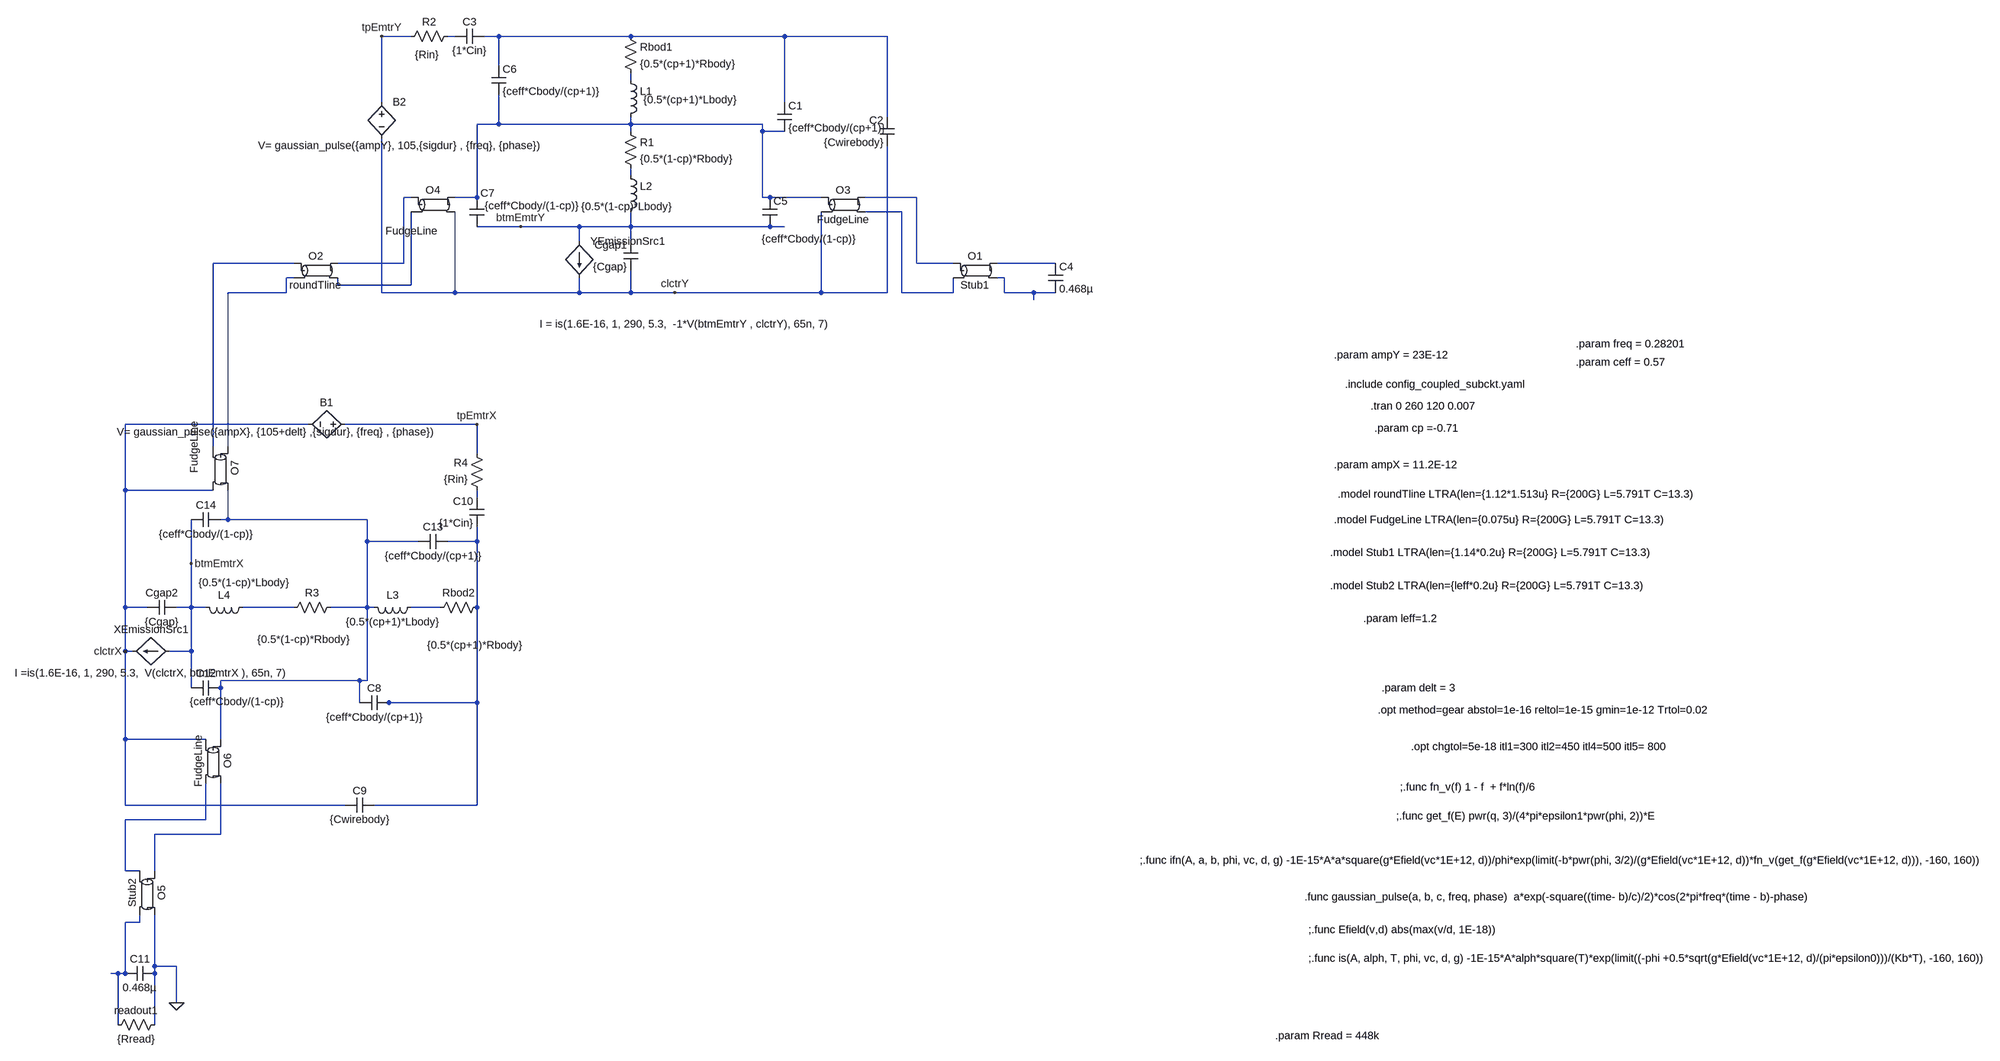
[diagram p0: schematic 2_coupled_antennas_with_currentCopy.asc]
2_coupled_antennas_with_currentCopy.asc, the LTspice schematic file:
Version 4.1
SHEET 1 2492 680
WIRE -1648 -1776 -1712 -1776
WIRE -1552 -1776 -1568 -1776
WIRE -1456 -1776 -1488 -1776
WIRE -1168 -1776 -1456 -1776
WIRE -832 -1776 -1168 -1776
WIRE -608 -1776 -832 -1776
WIRE -1456 -1712 -1456 -1776
WIRE -1168 -1680 -1168 -1696
WIRE -1712 -1632 -1712 -1776
WIRE -832 -1632 -832 -1776
WIRE -608 -1600 -608 -1776
WIRE -1456 -1584 -1456 -1648
WIRE -1456 -1584 -1504 -1584
WIRE -1168 -1584 -1168 -1600
WIRE -1168 -1584 -1456 -1584
WIRE -880 -1584 -1168 -1584
WIRE -1168 -1568 -1168 -1584
WIRE -880 -1568 -880 -1584
WIRE -832 -1568 -880 -1568
WIRE -1168 -1472 -1168 -1488
WIRE -1648 -1424 -1664 -1424
WIRE -1504 -1424 -1504 -1584
WIRE -1504 -1424 -1552 -1424
WIRE -880 -1424 -880 -1568
WIRE -864 -1424 -880 -1424
WIRE -752 -1424 -864 -1424
WIRE -544 -1424 -656 -1424
WIRE -1504 -1408 -1504 -1424
WIRE -576 -1392 -656 -1392
WIRE -1408 -1360 -1504 -1360
WIRE -1280 -1360 -1408 -1360
WIRE -1168 -1360 -1168 -1392
WIRE -1168 -1360 -1280 -1360
WIRE -864 -1360 -1168 -1360
WIRE -832 -1360 -864 -1360
WIRE -1280 -1328 -1280 -1360
WIRE -1168 -1328 -1168 -1360
WIRE -1904 -1280 -2080 -1280
WIRE -1664 -1280 -1664 -1424
WIRE -1664 -1280 -1808 -1280
WIRE -544 -1280 -544 -1424
WIRE -464 -1280 -544 -1280
WIRE -240 -1280 -368 -1280
WIRE -1904 -1248 -1920 -1248
WIRE -352 -1248 -368 -1248
WIRE -1808 -1232 -1808 -1248
WIRE -1648 -1232 -1648 -1392
WIRE -1648 -1232 -1808 -1232
WIRE -1920 -1216 -1920 -1248
WIRE -1920 -1216 -2048 -1216
WIRE -1712 -1216 -1712 -1552
WIRE -1552 -1216 -1552 -1392
WIRE -1552 -1216 -1712 -1216
WIRE -1280 -1216 -1280 -1248
WIRE -1280 -1216 -1552 -1216
WIRE -1168 -1216 -1168 -1264
WIRE -1168 -1216 -1280 -1216
WIRE -1072 -1216 -1168 -1216
WIRE -752 -1216 -752 -1392
WIRE -752 -1216 -1072 -1216
WIRE -608 -1216 -608 -1536
WIRE -608 -1216 -752 -1216
WIRE -576 -1216 -576 -1392
WIRE -464 -1216 -464 -1248
WIRE -464 -1216 -576 -1216
WIRE -352 -1216 -352 -1248
WIRE -288 -1216 -352 -1216
WIRE -240 -1216 -288 -1216
WIRE -288 -1200 -288 -1216
WIRE -1872 -928 -2272 -928
WIRE -1504 -928 -1792 -928
WIRE -2080 -880 -2080 -1280
WIRE -2048 -880 -2048 -1216
WIRE -1504 -864 -1504 -928
WIRE -2272 -784 -2272 -928
WIRE -2080 -784 -2272 -784
WIRE -1504 -768 -1504 -784
WIRE -2048 -720 -2048 -784
WIRE -2048 -720 -2064 -720
WIRE -1744 -720 -2048 -720
WIRE -1744 -672 -1744 -720
WIRE -1632 -672 -1744 -672
WIRE -1504 -672 -1504 -704
WIRE -1504 -672 -1568 -672
WIRE -2128 -624 -2128 -720
WIRE -2272 -528 -2272 -784
WIRE -2224 -528 -2272 -528
WIRE -2128 -528 -2128 -624
WIRE -2128 -528 -2160 -528
WIRE -2096 -528 -2128 -528
WIRE -1904 -528 -2016 -528
WIRE -1744 -528 -1744 -672
WIRE -1744 -528 -1824 -528
WIRE -1728 -528 -1744 -528
WIRE -1584 -528 -1648 -528
WIRE -1504 -528 -1504 -672
WIRE -2272 -432 -2272 -528
WIRE -2256 -432 -2272 -432
WIRE -2128 -432 -2128 -528
WIRE -2128 -432 -2176 -432
WIRE -1760 -368 -2064 -368
WIRE -1744 -368 -1744 -528
WIRE -1744 -368 -1760 -368
WIRE -2128 -352 -2128 -432
WIRE -2064 -352 -2064 -368
WIRE -1760 -320 -1760 -368
WIRE -1696 -320 -1712 -320
WIRE -1504 -320 -1504 -528
WIRE -1504 -320 -1696 -320
WIRE -2272 -240 -2272 -432
WIRE -2096 -240 -2272 -240
WIRE -2064 -240 -2064 -352
WIRE -2272 -96 -2272 -240
WIRE -1792 -96 -2272 -96
WIRE -1504 -96 -1504 -320
WIRE -1504 -96 -1728 -96
WIRE -2096 -64 -2096 -144
WIRE -2096 -64 -2272 -64
WIRE -2064 -32 -2064 -144
WIRE -2064 -32 -2208 -32
WIRE -2272 48 -2272 -64
WIRE -2240 48 -2272 48
WIRE -2208 48 -2208 -32
WIRE -2240 160 -2240 144
WIRE -2240 160 -2272 160
WIRE -2208 256 -2208 144
WIRE -2160 256 -2208 256
WIRE -2288 272 -2304 272
WIRE -2272 272 -2272 160
WIRE -2272 272 -2288 272
WIRE -2208 272 -2208 256
WIRE -2160 336 -2160 256
WIRE -2288 384 -2288 272
WIRE -2208 384 -2208 272
FLAG -1408 -1360 btmEmtrY
FLAG -1072 -1216 clctrY
FLAG -1712 -1776 tpEmtrY
FLAG -2128 -624 btmEmtrX
FLAG -2272 -432 clctrX
FLAG -1504 -928 tpEmtrX
FLAG -2160 336 0
SYMBOL cap -848 -1632 R0
SYMATTR InstName C1
SYMATTR Value {ceff*Cbody/(cp+1)}
SYMBOL cap -1152 -1264 R180
WINDOW 0 24 56 Left 2
WINDOW 3 24 8 Left 2
SYMATTR InstName Cgap1
SYMATTR Value {Cgap}
SYMBOL cap -592 -1536 R180
WINDOW 0 24 56 Left 2
WINDOW 3 24 8 Left 2
SYMATTR InstName C2
SYMATTR Value {Cwirebody}
SYMBOL res -1184 -1792 R0
SYMATTR InstName Rbod1
SYMATTR Value {0.5*(cp+1)*Rbody}
SYMBOL res -1184 -1584 R0
SYMATTR InstName R1
SYMATTR Value {0.5*(1-cp)*Rbody}
SYMBOL ind -1184 -1696 R0
WINDOW 3 44 59 Left 2
SYMATTR Value {0.5*(cp+1)*Lbody}
SYMATTR InstName L1
SYMBOL ind -1184 -1488 R0
WINDOW 3 -92 84 Left 2
SYMATTR Value {0.5*(1-cp)*Lbody}
SYMATTR InstName L2
SYMBOL res -1552 -1792 R90
WINDOW 0 0 56 VBottom 2
WINDOW 3 41 61 VTop 2
SYMATTR InstName R2
SYMATTR Value {Rin}
SYMBOL cap -1488 -1792 R90
WINDOW 0 0 32 VBottom 2
WINDOW 3 32 32 VTop 2
SYMATTR InstName C3
SYMATTR Value {1*Cin}
SYMBOL ltline -416 -1264 R0
SYMATTR InstName O1
SYMATTR Value Stub1
SYMBOL ltline -1856 -1264 R0
SYMATTR InstName O2
SYMATTR Value roundTline
SYMBOL cap -256 -1280 R0
SYMATTR InstName C4
SYMATTR Value 0.468µ
SYMBOL cap -880 -1424 R0
WINDOW 3 -2 91 Left 2
SYMATTR Value {ceff*Cbody/(1-cp)}
SYMATTR InstName C5
SYMBOL cap -1472 -1712 R0
SYMATTR InstName C6
SYMATTR Value {ceff*Cbody/(cp+1)}
SYMBOL cap -1520 -1424 R0
WINDOW 0 24 -9 Left 2
WINDOW 3 33 18 Left 2
SYMATTR InstName C7
SYMATTR Value {ceff*Cbody/(1-cp)}
SYMBOL ltline -704 -1408 R0
SYMATTR InstName O3
SYMATTR Value FudgeLine
SYMBOL ltline -1600 -1408 R0
WINDOW 3 -46 42 Top 2
SYMATTR Value FudgeLine
SYMATTR InstName O4
SYMBOL cap -1696 -336 R90
WINDOW 0 0 32 VBottom 2
WINDOW 3 32 32 VTop 2
SYMATTR InstName C8
SYMATTR Value {ceff*Cbody/(cp+1)}
SYMBOL cap -2224 -512 R270
WINDOW 0 32 32 VTop 2
WINDOW 3 0 32 VBottom 2
SYMATTR InstName Cgap2
SYMATTR Value {Cgap}
SYMBOL cap -1792 -80 R270
WINDOW 0 32 32 VTop 2
WINDOW 3 0 32 VBottom 2
SYMATTR InstName C9
SYMATTR Value {Cwirebody}
SYMBOL res -1488 -544 R90
WINDOW 0 0 56 VBottom 2
WINDOW 3 83 21 VTop 2
SYMATTR InstName Rbod2
SYMATTR Value {0.5*(cp+1)*Rbody}
SYMBOL res -1808 -544 R90
WINDOW 0 0 56 VBottom 2
WINDOW 3 70 75 VTop 2
SYMATTR InstName R3
SYMATTR Value {0.5*(1-cp)*Rbody}
SYMBOL ind -1632 -544 R90
WINDOW 3 32 56 VTop 2
WINDOW 0 5 56 VBottom 2
SYMATTR Value {0.5*(cp+1)*Lbody}
SYMATTR InstName L3
SYMBOL ind -2000 -544 R90
WINDOW 3 -54 13 VTop 2
WINDOW 0 5 56 VBottom 2
SYMATTR Value {0.5*(1-cp)*Lbody}
SYMATTR InstName L4
SYMBOL res -1488 -768 R180
WINDOW 0 36 76 Left 2
WINDOW 3 36 40 Left 2
SYMATTR InstName R4
SYMATTR Value {Rin}
SYMBOL cap -1488 -704 R180
WINDOW 0 24 56 Left 2
WINDOW 3 24 8 Left 2
SYMATTR InstName C10
SYMATTR Value {1*Cin}
SYMBOL ltline -2224 96 R90
SYMATTR InstName O5
SYMATTR Value Stub2
SYMBOL cap -2208 256 R90
WINDOW 0 0 32 VBottom 2
WINDOW 3 31 33 VTop 2
SYMATTR InstName C11
SYMATTR Value 0.468µ
SYMBOL cap -2064 -368 R90
WINDOW 3 30 -35 VTop 2
WINDOW 0 0 32 VBottom 2
SYMATTR Value {ceff*Cbody/(1-cp)}
SYMATTR InstName C12
SYMBOL cap -1568 -688 R90
WINDOW 0 0 32 VBottom 2
WINDOW 3 32 32 VTop 2
SYMATTR InstName C13
SYMATTR Value {ceff*Cbody/(cp+1)}
SYMBOL cap -2064 -736 R90
WINDOW 0 0 32 VBottom 2
WINDOW 3 32 32 VTop 2
SYMATTR InstName C14
SYMATTR Value {ceff*Cbody/(1-cp)}
SYMBOL ltline -2080 -192 R90
SYMATTR InstName O6
SYMATTR Value FudgeLine
SYMBOL ltline -2064 -832 R90
WINDOW 3 -46 42 Top 2
SYMATTR Value FudgeLine
SYMATTR InstName O7
SYMBOL bi -1280 -1328 R0
WINDOW 3 -87 181 Left 2
SYMATTR Value I = is(1.6E-16, 1, 290, 5.3,  -1*V(btmEmtrY , clctrY), 65n, 7)
SYMATTR InstName YEmissionSrc1
SYMBOL bi -2176 -432 R90
WINDOW 3 32 40 VTop 2
WINDOW 0 -32 40 VBottom 2
SYMATTR Value I =is(1.6E-16, 1, 290, 5.3,  V(clctrX, btmEmtrX ), 65n, 7)
SYMATTR InstName XEmissionSrc1
SYMBOL bv -1776 -928 R90
WINDOW 3 1 167 VTop 2
WINDOW 0 -32 56 VBottom 2
SYMATTR Value V= gaussian_pulse({ampX}, {105+delt} ,{sigdur}, {freq} , {phase})
SYMATTR InstName B1
SYMBOL bv -1712 -1648 R0
WINDOW 3 -270 111 Left 2
SYMATTR Value V= gaussian_pulse({ampY}, 105,{sigdur} , {freq}, {phase})
SYMATTR InstName B2
SYMBOL res -2192 368 R90
WINDOW 0 0 56 VBottom 2
WINDOW 3 32 56 VTop 2
SYMATTR InstName readout1
SYMATTR Value {Rread}
TEXT 832 -1016 Left 2 !.include config_coupled_subckt.yaml
TEXT 888 -968 Left 2 !.tran 0 260 120 0.007
TEXT 904 -304 Left 2 !.opt method=gear abstol=1e-16 reltol=1e-15 gmin=1e-12 Trtol=0.02
TEXT 976 -224 Left 2 !.opt chgtol=5e-18 itl1=300 itl2=450 itl4=500 itl5= 800
TEXT 952 -136 Left 2 !;.func fn_v(f) 1 - f  + f*ln(f)/6
TEXT 944 -72 Left 2 !;.func get_f(E) pwr(q, 3)/(4*pi*epsilon1*pwr(phi, 2))*E
TEXT 384 24 Left 2 !;.func ifn(A, a, b, phi, vc, d, g) -1E-15*A*a*square(g*Efield(vc*1E+12, d))/phi*exp(limit(-b*pwr(phi, 3/2)/(g*Efield(vc*1E+12, d))*fn_v(get_f(g*Efield(vc*1E+12, d))), -160, 160))
TEXT 744 104 Left 2 !.func gaussian_pulse(a, b, c, freq, phase)  a*exp(-square((time- b)/c)/2)*cos(2*pi*freq*(time - b)-phase)
TEXT 752 176 Left 2 !;.func Efield(v,d) abs(max(v/d, 1E-18))\n \n;.func is(A, alph, T, phi, vc, d, g) -1E-15*A*alph*square(T)*exp(limit((-phi +0.5*sqrt(g*Efield(vc*1E+12, d)/(pi*epsilon0)))/(Kb*T), -160, 160))
TEXT 808 -1080 Left 2 !.param ampY = 23E-12
TEXT 808 -840 Left 2 !.param ampX = 11.2E-12
TEXT 912 -352 Left 2 !.param delt = 3
TEXT 680 408 Left 2 !.param Rread = 448k
TEXT 1336 -1104 Left 2 !.param freq = 0.28201
TEXT 1336 -1064 Left 2 !.param ceff = 0.57
TEXT 816 -776 Left 2 !.model roundTline LTRA(len={1.12*1.513u} R={200G} L=5.791T C=13.3)
TEXT 808 -720 Left 2 !.model FudgeLine LTRA(len={0.075u} R={200G} L=5.791T C=13.3)
TEXT 800 -648 Left 2 !.model Stub1 LTRA(len={1.14*0.2u} R={200G} L=5.791T C=13.3)
TEXT 800 -576 Left 2 !.model Stub2 LTRA(len={leff*0.2u} R={200G} L=5.791T C=13.3)
TEXT 896 -920 Left 2 !.param cp =-0.71
TEXT 872 -504 Left 2 !.param leff=1.2

The netlist it stands for:
* 2_coupled_antennas_with_currentCopy.asc
C1 N002 N004 {ceff*Cbody/(cp+1)}
Cgap1 clctrY btmEmtrY {Cgap}
C2 clctrY N002 {Cwirebody}
Rbod1 N002 N003 {0.5*(cp+1)*Rbody}
R1 N004 N005 {0.5*(1-cp)*Rbody}
L1 N003 N004 {0.5*(cp+1)*Lbody}
L2 N005 btmEmtrY {0.5*(1-cp)*Lbody}
R2 N001 tpEmtrY {Rin}
C3 N002 N001 {1*Cin}
O1 N007 N008 N010 N012 Stub1
O2 N009 N011 N006 N013 roundTline
C4 N010 N012 0.468µ
C5 N004 btmEmtrY {ceff*Cbody/(1-cp)}
C6 N002 N004 {ceff*Cbody/(cp+1)}
C7 N004 btmEmtrY {ceff*Cbody/(1-cp)}
O3 N004 clctrY N007 N008 FudgeLine
O4 N006 N013 N004 clctrY FudgeLine
C8 N016 N015 {ceff*Cbody/(cp+1)}
Cgap2 clctrX btmEmtrX {Cgap}
C9 clctrX N016 {Cwirebody}
Rbod2 N016 N018 {0.5*(cp+1)*Rbody}
R3 N015 N017 {0.5*(1-cp)*Rbody}
L3 N018 N015 {0.5*(cp+1)*Lbody}
L4 N017 btmEmtrX {0.5*(1-cp)*Lbody}
R4 N014 tpEmtrX {Rin}
C10 N016 N014 {1*Cin}
O5 N020 N019 0 N021 Stub2
C11 0 N021 0.468µ
C12 N015 btmEmtrX {ceff*Cbody/(1-cp)}
C13 N016 N015 {ceff*Cbody/(cp+1)}
C14 N015 btmEmtrX {ceff*Cbody/(1-cp)}
O6 N015 clctrX N020 N019 FudgeLine
O7 N011 N009 N015 clctrX FudgeLine
B§YEmissionSrc1 btmEmtrY clctrY I = is(1.6E-16, 1, 290, 5.3,  -1*V(btmEmtrY , clctrY), 65n, 7)
B§XEmissionSrc1 btmEmtrX clctrX I =is(1.6E-16, 1, 290, 5.3,  V(clctrX, btmEmtrX ), 65n, 7)
B1 tpEmtrX clctrX V= gaussian_pulse({ampX}, {105+delt} ,{sigdur}, {freq} , {phase})
B2 tpEmtrY clctrY V= gaussian_pulse({ampY}, 105,{sigdur} , {freq}, {phase})
readout1 0 N021 {Rread}
.include config_coupled_subckt.yaml
.tran 0 260 120 0.007
.opt method=gear abstol=1e-16 reltol=1e-15 gmin=1e-12 Trtol=0.02
.opt chgtol=5e-18 itl1=300 itl2=450 itl4=500 itl5= 800
;.func fn_v(f) 1 - f  + f*ln(f)/6
;.func get_f(E) pwr(q, 3)/(4*pi*epsilon1*pwr(phi, 2))*E
;.func ifn(A, a, b, phi, vc, d, g) -1E-15*A*a*square(g*Efield(vc*1E+12, d))/phi*exp(limit(-b*pwr(phi, 3/2)/(g*Efield(vc*1E+12, d))*fn_v(get_f(g*Efield(vc*1E+12, d))), -160, 160))
.func gaussian_pulse(a, b, c, freq, phase)  a*exp(-square((time- b)/c)/2)*cos(2*pi*freq*(time - b)-phase)
;.func Efield(v,d) abs(max(v/d, 1E-18))
;.func is(A, alph, T, phi, vc, d, g) -1E-15*A*alph*square(T)*exp(limit((-phi +0.5*sqrt(g*Efield(vc*1E+12, d)/(pi*epsilon0)))/(Kb*T), -160, 160))
.param ampY = 23E-12
.param ampX = 11.2E-12
.param delt = 3
.param Rread = 448k
.param freq = 0.28201
.param ceff = 0.57
.model roundTline LTRA(len={1.12*1.513u} R={200G} L=5.791T C=13.3)
.model FudgeLine LTRA(len={0.075u} R={200G} L=5.791T C=13.3)
.model Stub1 LTRA(len={1.14*0.2u} R={200G} L=5.791T C=13.3)
.model Stub2 LTRA(len={leff*0.2u} R={200G} L=5.791T C=13.3)
.param cp =-0.71
.param leff=1.2
.backanno
.end